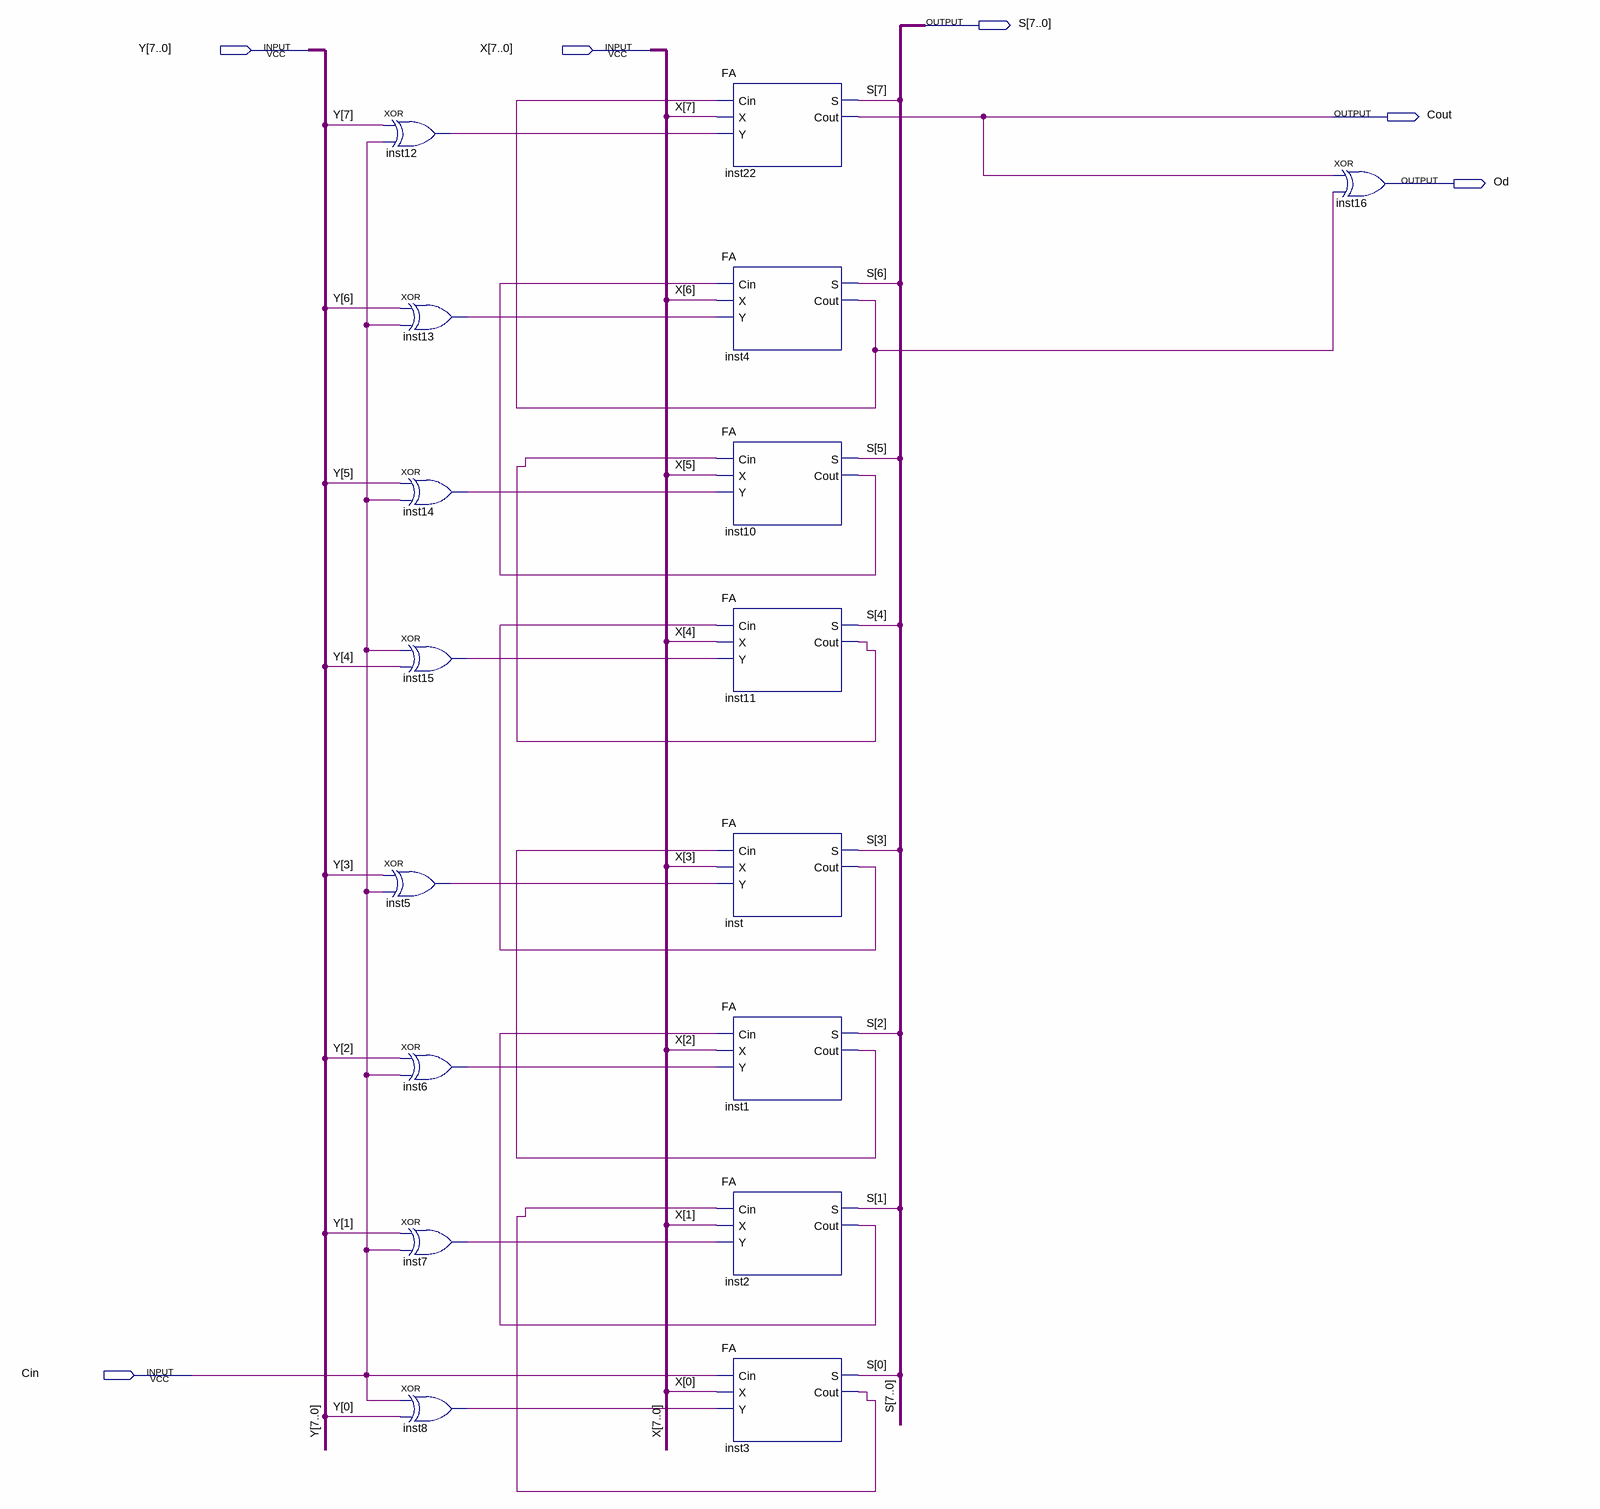
[diagram p0: schematic sheet]
// Quartus schematic adder_8bit.bdf as structural Verilog: 17 symbols, 6 pins
module adder_8bit (
  input  [7:0] Y,
  input  [7:0] X,
  input  Cin,
  output [7:0] S,
  output Cout,
  output Od
);

  wire inst1_cout, inst2_cout, inst3_cout, inst4_cout, inst5_out, inst6_out, inst7_out, inst8_out,
       inst10_cout, inst11_cout, inst12_out, inst13_out, inst14_out, inst15_out, inst_cout;

  xor inst12 (inst12_out, Y[7], Cin);
  xor inst13 (inst13_out, Y[6], Cin);
  xor inst14 (inst14_out, Y[5], Cin);
  xor inst15 (inst15_out, Cin, Y[4]);
  xor inst5 (inst5_out, Y[3], Cin);
  xor inst6 (inst6_out, Y[2], Cin);
  xor inst7 (inst7_out, Y[1], Cin);
  xor inst8 (inst8_out, Cin, Y[0]);
  FA inst22 (.Cin(inst4_cout), .X(X[7]), .Y(inst12_out), .S(S[7]), .Cout(Cout));
  FA inst4 (.Cin(inst10_cout), .X(X[6]), .Y(inst13_out), .S(S[6]), .Cout(inst4_cout));
  FA inst10 (.Cin(inst11_cout), .X(X[5]), .Y(inst14_out), .S(S[5]), .Cout(inst10_cout));
  FA inst11 (.Cin(inst_cout), .X(X[4]), .Y(inst15_out), .S(S[4]), .Cout(inst11_cout));
  FA inst (.Cin(inst1_cout), .X(X[3]), .Y(inst5_out), .S(S[3]), .Cout(inst_cout));
  FA inst1 (.Cin(inst2_cout), .X(X[2]), .Y(inst6_out), .S(S[2]), .Cout(inst1_cout));
  FA inst2 (.Cin(inst3_cout), .X(X[1]), .Y(inst7_out), .S(S[1]), .Cout(inst2_cout));
  FA inst3 (.Cin(Cin), .X(X[0]), .Y(inst8_out), .S(S[0]), .Cout(inst3_cout));
  xor inst16 (Od, Cout, inst4_cout);
endmodule
